# EAGLE design Clipcord BOT (EAGLE 9.6.2)
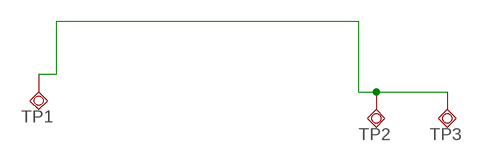
[diagram p0: schematic, sheet 1]

## Parts
TP1  TESTPAD_TPSQB1,27  [TESTPAD_B1,27]
TP2  TESTPAD_TPSQB1,27  [TESTPAD_B1,27]
TP3  TESTPAD_TPSQB1,27  [TESTPAD_B1,27]

## Nets
LINE: TP1.TP TP2.TP TP3.TP

## Library data of the parts
TP1-TP3 = BeagleBone_Blue_R3:TESTPAD_TPSQ: Test pad

## Board
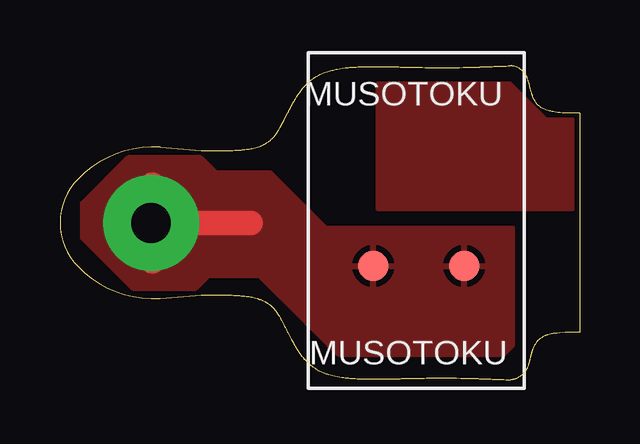
[diagram p1: board, top side]
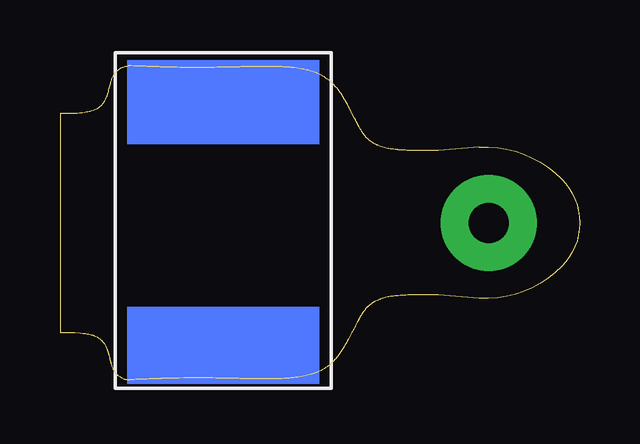
[diagram p2: board, bottom side, seen from below]

Size 21.65 x 13.1 mm. Coordinates in mm from the lower left corner, seen from the top.
Outline: 14.67,0.06 14.67,0.06 14.66,0.06 14.66,0.06 14.64,0.06 14.62,0.06 14.6,0.06 14.58,0.06 14.55,0.06 14.52,0.06 14.49,0.06 14.45,0.06 14.41,0.05 14.37,0.05 14.33,0.05 14.28,0.05 14.23,0.05 14.17,0.05 14.12,0.05 14.11,0.05 14.1,0.05 14.1,0.05 14.09,0.05 14.06,0.05 14,0.05 13.93,0.04 13.86,0.04 13.8,0.04 13.74,0.04 13.69,0.04 13.64,0.04 13.6,0.04 13.59,0.04 13.58,0.04 13.57,0.04 13.57,0.04 13.56,0.04 13.55,0.04 13.54,0.04 13.47,0.04 13.4,0.03 13.32,0.03 13.24,0.03 13.16,0.03 13.09,0.03 13.01,0.03 12.94,0.03 12.87,0.03 12.81,0.03 12.74,0.04 12.7,0.04 12.65,0.04 12.6,0.04 12.54,0.04 12.49,0.04 12.44,0.04 12.39,0.05 12.3,0.05 12.22,0.06 12.13,0.06 12.08,0.07 12.03,0.07 11.98,0.08 11.93,0.08 11.88,0.09 11.83,0.09 11.73,0.11 11.64,0.12 11.55,0.14 11.46,0.16 11.37,0.18 11.29,0.2 11.21,0.22 11.17,0.23 11.13,0.24 11.09,0.26 11.05,0.27 11.02,0.28 10.98,0.3 10.94,0.31 10.87,0.35 10.79,0.38 10.72,0.42 10.65,0.46 10.61,0.49 10.56,0.52 10.52,0.55 10.48,0.58 10.44,0.61 10.38,0.66 10.31,0.72 10.25,0.78 10.2,0.84 10.18,0.86 10.17,0.87 10.16,0.88 10.15,0.9 10.14,0.91 10.12,0.93 10.08,0.98 10.03,1.04 9.99,1.1 9.95,1.16 9.91,1.22 9.87,1.29 9.83,1.36 9.82,1.36 9.82,1.37 9.82,1.37 9.81,1.38 9.81,1.38 9.81,1.39 9.78,1.44 9.75,1.49 9.71,1.55 9.67,1.62 9.64,1.69 9.59,1.77 9.55,1.85 9.53,1.89 9.51,1.93 9.49,1.97 9.47,2 9.46,2.04 9.44,2.08 9.42,2.11 9.4,2.15 9.38,2.19 9.35,2.24 9.33,2.29 9.3,2.34 9.28,2.38 9.26,2.42 9.24,2.46 9.22,2.5 9.21,2.51 9.21,2.51 9.2,2.52 9.2,2.53 9.2,2.54 9.19,2.54 9.19,2.55 9.17,2.58 9.15,2.61 9.13,2.66 9.1,2.7 9.08,2.73 9.07,2.75 9.06,2.77 9.04,2.79 9.03,2.81 9.02,2.83 9,2.85 8.96,2.9 8.93,2.95 8.89,2.99 8.88,3 8.86,3.02 8.85,3.03 8.84,3.04 8.82,3.06 8.81,3.07 8.79,3.08 8.75,3.12 8.71,3.15 8.66,3.19 8.64,3.2 8.62,3.21 8.6,3.23 8.58,3.24 8.56,3.25 8.54,3.26 8.48,3.29 8.42,3.32 8.36,3.34 8.33,3.35 8.31,3.36 8.29,3.37 8.26,3.38 8.23,3.39 8.21,3.39 8.14,3.41 8.07,3.43 8,3.45 7.94,3.46 7.89,3.47 7.83,3.48 7.76,3.49 7.7,3.49 7.63,3.5 7.55,3.51 7.48,3.51 7.4,3.52 7.39,3.52 7.37,3.52 7.35,3.52 7.34,3.52 7.32,3.52 7.3,3.52 7.24,3.53 7.17,3.53 7.1,3.53 7.03,3.53 6.96,3.54 6.89,3.54 6.81,3.54 6.74,3.54 6.72,3.54 6.71,3.54 6.7,3.54 6.69,3.54 6.68,3.54 6.67,3.54 6.63,3.54 6.59,3.54 6.54,3.54 6.49,3.54 6.44,3.54 6.38,3.54 6.32,3.54 6.26,3.54 6.19,3.54 6.12,3.54 6.05,3.54 5.97,3.54 5.89,3.54 4.18,3.39 arc-48 0.75,4.72 arc-89 0.75,8.38 arc-48 4.18,9.71 5.89,9.56 5.97,9.56 6.05,9.56 6.12,9.56 6.19,9.56 6.26,9.56 6.32,9.56 6.38,9.56 6.44,9.56 6.49,9.56 6.54,9.56 6.59,9.56 6.63,9.56 6.67,9.56 6.68,9.56 6.69,9.56 6.7,9.56 6.71,9.56 6.72,9.56 6.74,9.56 6.81,9.56 6.9,9.56 6.98,9.56 7.06,9.56 7.13,9.57 7.21,9.57 7.27,9.57 7.34,9.58 7.4,9.58 7.43,9.58 7.46,9.58 7.49,9.59 7.52,9.59 7.55,9.59 7.58,9.59 7.61,9.6 7.69,9.6 7.76,9.61 7.83,9.62 7.89,9.63 7.94,9.64 8,9.65 8.08,9.67 8.15,9.69 8.22,9.71 8.29,9.73 8.36,9.75 8.39,9.77 8.42,9.78 8.45,9.79 8.48,9.81 8.51,9.82 8.54,9.84 8.58,9.86 8.62,9.89 8.66,9.91 8.69,9.93 8.72,9.96 8.75,9.98 8.78,10 8.81,10.03 8.84,10.06 8.86,10.08 8.89,10.11 8.91,10.13 8.92,10.15 8.94,10.17 8.95,10.19 8.97,10.21 8.99,10.23 9,10.25 9.02,10.27 9.03,10.29 9.04,10.31 9.06,10.33 9.07,10.35 9.08,10.37 9.11,10.41 9.13,10.45 9.16,10.5 9.19,10.55 9.22,10.6 9.23,10.62 9.24,10.64 9.25,10.66 9.26,10.68 9.27,10.7 9.28,10.72 9.29,10.74 9.3,10.76 9.34,10.83 9.37,10.89 9.49,11.13 9.51,11.16 9.52,11.19 9.54,11.22 9.56,11.26 9.57,11.29 9.61,11.35 9.64,11.41 9.67,11.47 9.71,11.53 9.74,11.59 9.76,11.62 9.77,11.65 9.79,11.68 9.8,11.71 9.82,11.73 9.84,11.76 9.86,11.8 9.9,11.86 9.94,11.93 9.98,11.98 10.03,12.04 10.07,12.1 10.11,12.16 10.15,12.21 10.2,12.26 10.21,12.28 10.23,12.3 10.25,12.32 10.27,12.34 10.29,12.35 10.31,12.37 10.33,12.39 10.38,12.44 10.44,12.49 10.51,12.54 10.58,12.59 10.65,12.64 10.71,12.67 10.78,12.71 10.84,12.74 10.91,12.77 10.98,12.8 11.05,12.83 11.13,12.85 11.21,12.88 11.26,12.89 11.32,12.91 11.38,12.92 11.44,12.94 11.5,12.95 11.56,12.96 11.66,12.98 11.77,13 11.88,13.01 11.91,13.01 11.95,13.02 11.98,13.02 12.02,13.03 12.05,13.03 12.09,13.03 12.13,13.04 12.2,13.04 12.27,13.05 12.35,13.05 12.4,13.05 12.45,13.05 12.5,13.06 12.56,13.06 12.61,13.06 12.67,13.06 12.71,13.06 12.76,13.06 12.84,13.06 12.92,13.07 13.01,13.07 13.1,13.07 13.19,13.07 13.29,13.06 13.39,13.06 13.49,13.06 13.6,13.06 13.61,13.06 13.62,13.06 13.63,13.06 13.64,13.06 13.65,13.06 13.66,13.06 13.67,13.06 13.68,13.06 13.71,13.06 13.75,13.06 13.79,13.06 13.84,13.06 13.89,13.06 13.94,13.05 13.99,13.05 14.04,13.05 14.08,13.05 14.09,13.05 14.1,13.05 14.1,13.05 14.11,13.05 14.11,13.05 14.12,13.05 14.17,13.05 14.21,13.05 14.26,13.05 14.31,13.05 14.35,13.05 14.4,13.04 14.43,13.04 14.47,13.04 14.5,13.04 14.53,13.04 14.56,13.04 14.59,13.04 14.61,13.04 14.63,13.04 14.65,13.04 14.66,13.04 14.67,13.04 14.67,13.04 14.67,13.04 14.69,13.04 14.7,13.04 14.72,13.04 14.73,13.04 14.75,13.04 14.83,13.03 14.9,13.03 14.97,13.03 15.1,13.03 15.22,13.03 15.32,13.03 15.43,13.03 15.53,13.02 15.62,13.02 15.71,13.02 15.8,13.02 15.89,13.02 15.9,13.02 15.91,13.02 15.93,13.02 15.94,13.02 15.96,13.02 15.97,13.02 16.04,13.02 16.16,13.02 16.32,13.02 16.48,13.02 16.64,13.03 16.8,13.03 16.95,13.03 17.1,13.04 17.21,13.04 17.26,13.04 17.27,13.04 17.27,13.04 17.28,13.04 17.28,13.04 17.29,13.04 17.29,13.04 17.29,13.04 17.3,13.04 17.32,13.04 17.33,13.04 17.35,13.04 17.37,13.05 17.39,13.05 17.41,13.05 17.45,13.05 17.48,13.05 17.52,13.05 17.56,13.05 17.61,13.05 17.65,13.06 17.71,13.06 17.76,13.06 17.82,13.06 17.88,13.06 17.94,13.07 18.01,13.07 18.08,13.07 18.15,13.07 18.23,13.08 18.31,13.08 18.4,13.08 18.49,13.09 18.58,13.09 18.68,13.09 18.78,13.1 18.82,13.09 18.85,13.09 18.89,13.09 18.93,13.08 18.97,13.06 19.01,13.05 19.05,13.03 19.09,13.01 19.13,12.99 19.16,12.97 19.2,12.94 19.24,12.91 19.26,12.89 19.29,12.86 19.32,12.83 19.34,12.81 19.36,12.78 19.42,12.7 19.46,12.62 19.47,12.59 19.49,12.55 19.5,12.51 19.52,12.46 19.53,12.41 19.55,12.35 19.56,12.29 19.58,12.23 19.6,12.16 19.61,12.09 19.63,12.03 19.65,11.97 19.66,11.92 19.67,11.9 19.67,11.88 19.68,11.86 19.69,11.84 19.69,11.83 19.7,11.81 19.74,11.71 19.79,11.62 19.85,11.53 19.92,11.46 19.94,11.43 19.97,11.41 20,11.38 20.04,11.36 20.07,11.34 20.1,11.32 20.18,11.28 20.26,11.25 20.34,11.22 20.39,11.21 20.44,11.2 20.5,11.19 20.56,11.18 20.63,11.17 20.74,11.15 20.84,11.14 20.94,11.13 21.05,11.12 21.65,11.12 21.65,1.98 21.05,1.98 20.81,1.95 20.71,1.94 20.7,1.94 20.69,1.94 20.68,1.94 20.67,1.94 20.65,1.93 20.64,1.93 20.63,1.93 20.61,1.93 20.61,1.93 20.6,1.93 20.59,1.93 20.59,1.93 20.59,1.93 20.58,1.93 20.58,1.93 20.53,1.92 20.5,1.91 20.46,1.91 20.4,1.89 20.34,1.88 20.32,1.87 20.3,1.86 20.27,1.86 20.25,1.85 20.23,1.84 20.2,1.83 20.15,1.81 20.1,1.78 20.06,1.76 20.02,1.73 19.98,1.7 19.95,1.67 19.92,1.64 19.9,1.63 19.89,1.61 19.88,1.6 19.87,1.59 19.86,1.58 19.85,1.57 19.84,1.55 19.82,1.52 19.79,1.48 19.77,1.43 19.74,1.38 19.72,1.33 19.7,1.28 19.69,1.26 19.68,1.25 19.68,1.23 19.67,1.21 19.67,1.2 19.66,1.18 19.66,1.16 19.65,1.14 19.65,1.13 19.64,1.11 19.64,1.1 19.63,1.08 19.63,1.07 19.63,1.06 19.62,1.04 19.61,1.01 19.61,0.98 19.6,0.95 19.59,0.91 19.58,0.87 19.57,0.85 19.57,0.83 19.56,0.81 19.56,0.79 19.56,0.78 19.55,0.76 19.55,0.74 19.54,0.73 19.54,0.71 19.53,0.69 19.53,0.68 19.53,0.66 19.52,0.64 19.5,0.6 19.49,0.55 19.47,0.52 19.46,0.48 19.45,0.45 19.43,0.43 19.42,0.41 19.41,0.38 19.39,0.36 19.38,0.34 19.36,0.32 19.33,0.28 19.3,0.25 19.27,0.22 19.24,0.19 19.2,0.16 19.17,0.14 19.14,0.11 19.1,0.09 19.07,0.08 19.04,0.06 19.01,0.05 18.97,0.03 18.96,0.03 18.94,0.02 18.92,0.02 18.91,0.01 18.89,0.01 18.87,0.01 18.86,0.01 18.78,0 18.68,0 18.58,0.01 18.49,0.01 18.4,0.01 18.31,0.02 18.23,0.02 18.15,0.02 18.08,0.03 18.01,0.03 17.94,0.03 17.88,0.03 17.82,0.04 17.76,0.04 17.71,0.04 17.66,0.04 17.61,0.04 17.57,0.05 17.53,0.05 17.49,0.05 17.46,0.05 17.43,0.05 17.4,0.05 17.37,0.05 17.35,0.05 17.33,0.05 17.31,0.05 17.3,0.06 17.29,0.06 17.29,0.06 17.28,0.06 17.28,0.06 17.28,0.06 17.27,0.06 17.27,0.06 17.26,0.06 17.24,0.06 17.18,0.06 17.03,0.06 16.87,0.07 16.7,0.07 16.5,0.07 16.3,0.08 16.1,0.08 15.9,0.08 15.89,0.08 15.88,0.08 15.87,0.08 15.87,0.08 15.86,0.08 15.86,0.08 15.81,0.08 15.75,0.08 15.69,0.08 15.59,0.07 15.5,0.07 15.4,0.07 15.29,0.07 15.17,0.07 15.05,0.07 14.93,0.07 14.8,0.06 14.67,0.06
Outline: 14.67,0.06 14.67,0.06
Outline: 14.67,0.06 14.67,0.06
Outline: 14.67,0.06 14.67,0.06
Outline: 14.67,0.06 14.67,0.06
Copper layers (1*16): Top 0.035mm / dielectric 1.5mm / Bottom 0.035mm
Design rules "default *": minimum track width 6mil, minimum drill 0.35mm, track to track 6mil, track to pad 6mil, pad to pad 6mil, via to via 6mil, smd to smd 6mil, copper to edge 0mil, drill to drill 6mil, minimum pad ring 10mil, minimum via ring 8mil, stop-mask expansion 4mil, vias tented up to drill 0mil, thermal gap 10mil

### Footprints (pad centres in the part's own frame; a part is rotated, then mirrored left to right if it is on the bottom)
TESTPAD_B1,27 = smd 1.27 x 1.27: TP 0,0

### Placement (x,y rotation side)
TP1  3.84,6.64 0 top
TP2  16.84,4.74 0 top
TP3  13.04,4.74 0 top

### Tracks (layer width: path | path; a pad name or v marks a point on that pad's centre or on a via)
LINE  (via drill 1.66 pad 4)
  Top 1.016: v3.79,6.54 7.94,6.54 | v3.79,6.54 3.84,6.59 3.84,8.14 | v3.79,6.54 3.84,6.49 3.84,4.94
  pour Top (isolate 0.5, rank 2): 2.84,9.24 0.94,7.34 0.94,5.94 3.04,3.84 5.64,3.84 6.44,4.64 6.44,8.64 5.84,9.24
  pour Top: 4.54,8.64 8.74,8.64 11.04,6.34 18.84,6.34 18.84,1.44 18.44,1.04 11.64,1.04 8.34,4.34 4.74,4.34 4.64,4.44 4.64,8.54
N$1
  pour Top: 13.24,7.14 21.34,7.14 21.34,10.84 20.24,10.84 18.74,12.34 13.24,12.34
(copper drawn outside any net)
  shapes: Bottom area x2

### Text on the board
tPlace: MUSOTOKU | MUSOTOKU